# Altium project MainBoard.PrjPcb
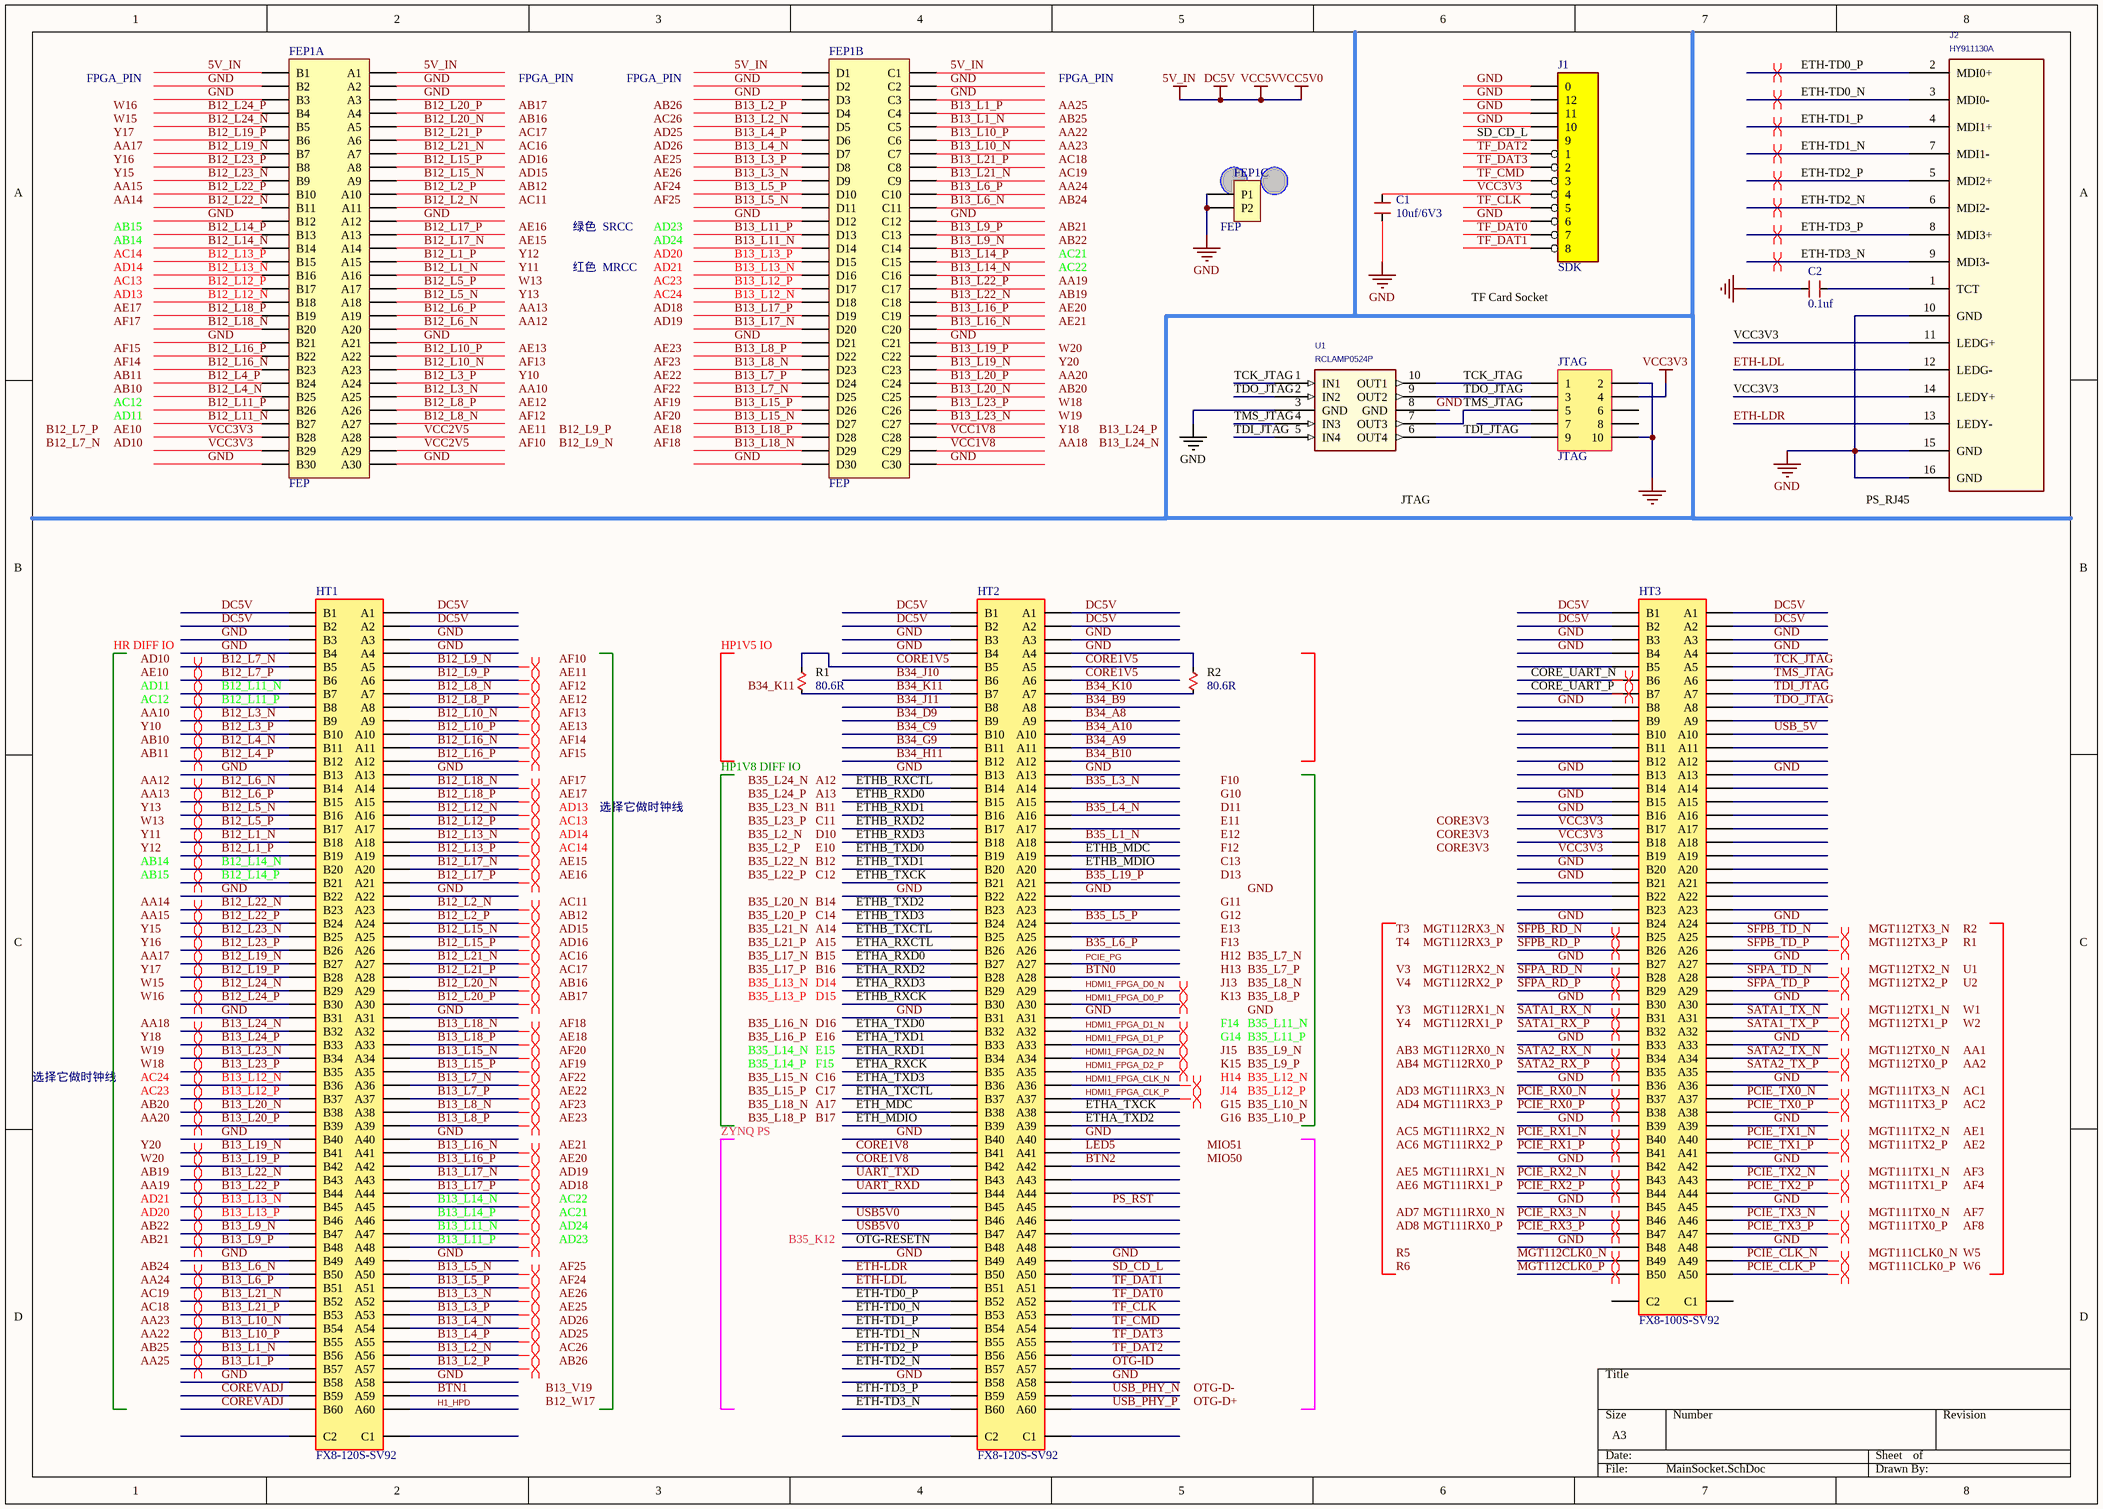
[diagram p0: MainSocket.SchDoc]
2 sheets, 57 parts. Net scope: global (net labels, ports and power ports of the same name join across sheets).
Board file: BASE.PcbDoc
Sheets:
  MainSocket.SchDoc
  Power.SchDoc

## Sheet MainSocket.SchDoc
size A3

### Parts
C1  10uf/6V3  [CAP0603]
C2  0.1uf  [CAP0402]
FEP1  FEP  [FEP-X2]  (parts A,B,C of 3)
HT1  FX8-120S-SV92  [FX8-120S-SV92]
HT2  FX8-120S-SV92  [FX8-120S-SV92]
HT3  FX8-100S-SV92  [FX8-100S-SV92]
J1  SDK  [TF_K]
J2  HY911130A  [HY911130A]
JTAG  JTAG  [HEADER5X2X2.0T]
R1  80.6R  [RES0402]
R2  80.6R  [RES0402]
U1  RCLAMP0524P  [SLP2510P8_10]

### Nets
5V_IN: FEP1.A1 FEP1.B1 FEP1.C1 FEP1.D1 HT1.A1 HT1.A2 HT1.B1 HT1.B2 HT2.A1 HT2.A2 HT2.B1 HT2.B2 HT3.A1 HT3.A2 HT3.B1 HT3.B2  [also labelled DC5V, VCC5V, VCC5V0]
GND: C1.2 C2.1 FEP1.A2 FEP1.A3 FEP1.A12 FEP1.A21 FEP1.A30 FEP1.B2 FEP1.B3 FEP1.B12 FEP1.B21 FEP1.B30 FEP1.C2 FEP1.C3 FEP1.C12 FEP1.C21 FEP1.C30 FEP1.D2 FEP1.D3 FEP1.D12 FEP1.D21 FEP1.D30 FEP1.P1 FEP1.P2 HT1.A3 HT1.A4 HT1.A13 HT1.A22 HT1.A31 HT1.A40 HT1.A49 HT1.A58 HT1.B3 HT1.B4 HT1.B13 HT1.B22 HT1.B31 HT1.B40 HT1.B49 HT1.B58 HT2.A3 HT2.A4 HT2.A13 HT2.A22 HT2.A31 HT2.A40 HT2.A49 HT2.A58 HT2.B3 HT2.B4 HT2.B13 HT2.B22 HT2.B31 HT2.B40 HT2.B49 HT2.B58 HT3.A3 HT3.A4 HT3.A13 HT3.A24 HT3.A27 HT3.A30 HT3.A33 HT3.A36 HT3.A39 HT3.A42 HT3.A45 HT3.A48 HT3.B3 HT3.B4 HT3.B8 HT3.B13 HT3.B15 HT3.B16 HT3.B20 HT3.B21 HT3.B24 HT3.B27 HT3.B30 HT3.B33 HT3.B36 HT3.B39 HT3.B42 HT3.B45 HT3.B48 J1.0 J1.6 J1.10 J1.11 J1.12 J2.10(GND) J2.15(GND) J2.16(GND) JTAG.2 JTAG.10 R2.2 U1.3(GND) U1.8(GND)
VCC1V8: FEP1.C28 FEP1.C29
VCC2V5: FEP1.A28 FEP1.A29
VCC3V3: C1.1 FEP1.B28 FEP1.B29 HT3.B17 HT3.B18 HT3.B19 J1.4 J2.11(LEDG+) J2.14(LEDY+) JTAG.4
B12_L1_N: FEP1.A16 HT1.B18
B12_L1_P: FEP1.A15 HT1.B19
B12_L2_N: FEP1.A11 HT1.A23
B12_L2_P: FEP1.A10 HT1.A24
B12_L3_N: FEP1.A25 HT1.B9
B12_L3_P: FEP1.A24 HT1.B10
B12_L4_N: FEP1.B25 HT1.B11
B12_L4_P: FEP1.B24 HT1.B12
B12_L5_N: FEP1.A18 HT1.B16
B12_L5_P: FEP1.A17 HT1.B17
B12_L6_N: FEP1.A20 HT1.B14
B12_L6_P: FEP1.A19 HT1.B15
B12_L7_N: HT1.B5
B12_L7_P: HT1.B6
B12_L8_N: FEP1.A27 HT1.A7
B12_L8_P: FEP1.A26 HT1.A8
B12_L9_N: HT1.A5
B12_L9_P: HT1.A6
B12_L10_N: FEP1.A23 HT1.A9
B12_L10_P: FEP1.A22 HT1.A10
B12_L11_N: FEP1.B27 HT1.B7
B12_L11_P: FEP1.B26 HT1.B8
B12_L12_N: FEP1.B18 HT1.A16
B12_L12_P: FEP1.B17 HT1.A17
B12_L13_N: FEP1.B16 HT1.A18
B12_L13_P: FEP1.B15 HT1.A19
B12_L14_N: FEP1.B14 HT1.B20
B12_L14_P: FEP1.B13 HT1.B21
B12_L15_N: FEP1.A9 HT1.A25
B12_L15_P: FEP1.A8 HT1.A26
B12_L16_N: FEP1.B23 HT1.A11
B12_L16_P: FEP1.B22 HT1.A12
B12_L17_N: FEP1.A14 HT1.A20
B12_L17_P: FEP1.A13 HT1.A21
B12_L18_N: FEP1.B20 HT1.A14
B12_L18_P: FEP1.B19 HT1.A15
B12_L19_N: FEP1.B7 HT1.B27
B12_L19_P: FEP1.B6 HT1.B28
B12_L20_N: FEP1.A5 HT1.A29
B12_L20_P: FEP1.A4 HT1.A30
B12_L21_N: FEP1.A7 HT1.A27
B12_L21_P: FEP1.A6 HT1.A28
B12_L22_N: FEP1.B11 HT1.B23
B12_L22_P: FEP1.B10 HT1.B24
B12_L23_N: FEP1.B9 HT1.B25
B12_L23_P: FEP1.B8 HT1.B26
B12_L24_N: FEP1.B5 HT1.B29
B12_L24_P: FEP1.B4 HT1.B30
B13_L1_N: FEP1.C5 HT1.B56
B13_L1_P: FEP1.C4 HT1.B57
B13_L2_N: FEP1.D5 HT1.A56
B13_L2_P: FEP1.D4 HT1.A57
B13_L3_N: FEP1.D9 HT1.A52
B13_L3_P: FEP1.D8 HT1.A53
B13_L4_N: FEP1.D7 HT1.A54
B13_L4_P: FEP1.D6 HT1.A55
B13_L5_N: FEP1.D11 HT1.A50
B13_L5_P: FEP1.D10 HT1.A51
B13_L6_N: FEP1.C11 HT1.B50
B13_L6_P: FEP1.C10 HT1.B51
B13_L7_N: FEP1.D25 HT1.A36
B13_L7_P: FEP1.D24 HT1.A37
B13_L8_N: FEP1.D23 HT1.A38
B13_L8_P: FEP1.D22 HT1.A39
B13_L9_N: FEP1.C14 HT1.B47
B13_L9_P: FEP1.C13 HT1.B48
B13_L10_N: FEP1.C7 HT1.B54
B13_L10_P: FEP1.C6 HT1.B55
B13_L11_N: FEP1.D14 HT1.A47
B13_L11_P: FEP1.D13 HT1.A48
B13_L12_N: FEP1.D18 HT1.B36
B13_L12_P: FEP1.D17 HT1.B37
B13_L13_N: FEP1.D16 HT1.B45
B13_L13_P: FEP1.D15 HT1.B46
B13_L14_N: FEP1.C16 HT1.A45
B13_L14_P: FEP1.C15 HT1.A46
B13_L15_N: FEP1.D27 HT1.A34
B13_L15_P: FEP1.D26 HT1.A35
B13_L16_N: FEP1.C20 HT1.A41
B13_L16_P: FEP1.C19 HT1.A42
B13_L17_N: FEP1.D20 HT1.A43
B13_L17_P: FEP1.D19 HT1.A44
B13_L18_N: FEP1.D29 HT1.A32
B13_L18_P: FEP1.D28 HT1.A33
B13_L19_N: FEP1.C23 HT1.B41
B13_L19_P: FEP1.C22 HT1.B42
B13_L20_N: FEP1.C25 HT1.B38
B13_L20_P: FEP1.C24 HT1.B39
B13_L21_N: FEP1.C9 HT1.B52
B13_L21_P: FEP1.C8 HT1.B53
B13_L22_N: FEP1.C18 HT1.B43
B13_L22_P: FEP1.C17 HT1.B44
B13_L23_N: FEP1.C27 HT1.B34
B13_L23_P: FEP1.C26 HT1.B35
B13_L24_N: HT1.B32
B13_L24_P: HT1.B33
B34_A8: HT2.A9
B34_A9: HT2.A11
B34_A10: HT2.A10
B34_B9: HT2.A8
B34_B10: HT2.A12
B34_C9: HT2.B10
B34_D9: HT2.B9
B34_G9: HT2.B11
B34_H11: HT2.B12
B34_J10: HT2.B6
B34_J11: HT2.B8
B34_K10: HT2.A7 R2.1
B34_K11: HT2.B7 R1.1
B35_L1_N: HT2.A18
B35_L3_N: HT2.A14
B35_L4_N: HT2.A16
B35_L5_P: HT2.A24
B35_L6_P: HT2.A26
B35_L19_P: HT2.A21
BTN0: HT2.A28
BTN1: HT1.A59
BTN2: HT2.A42
CORE1V5: HT2.A5 HT2.A6 HT2.B5 R1.2
CORE1V8: HT2.B41 HT2.B42
CORE_UART_N: HT3.B6
CORE_UART_P: HT3.B7
COREVADJ: HT1.B59 HT1.B60
ETH-LDL: HT2.B51 J2.12(LEDG-)
ETH-LDR: HT2.B50 J2.13(LEDY-)
ETH-TD0_N: HT2.B53 J2.3(MDI0-)
ETH-TD0_P: HT2.B52 J2.2(MDI0+)
ETH-TD1_N: HT2.B55 J2.7(MDI1-)
ETH-TD1_P: HT2.B54 J2.4(MDI1+)
ETH-TD2_N: HT2.B57 J2.6(MDI2-)
ETH-TD2_P: HT2.B56 J2.5(MDI2+)
ETH-TD3_N: HT2.B60 J2.9(MDI3-)
ETH-TD3_P: HT2.B59 J2.8(MDI3+)
ETH_MDC: HT2.B38
ETH_MDIO: HT2.B39
ETHA_RXCK: HT2.B35
ETHA_RXCTL: HT2.B26
ETHA_RXD0: HT2.B27
ETHA_RXD1: HT2.B34
ETHA_RXD2: HT2.B28
ETHA_RXD3: HT2.B29
ETHA_TXCK: HT2.A38
ETHA_TXCTL: HT2.B37
ETHA_TXD0: HT2.B32
ETHA_TXD1: HT2.B33
ETHA_TXD2: HT2.A39
ETHA_TXD3: HT2.B36
ETHB_MDC: HT2.A19
ETHB_MDIO: HT2.A20
ETHB_RXCK: HT2.B30
ETHB_RXCTL: HT2.B14
ETHB_RXD0: HT2.B15
ETHB_RXD1: HT2.B16
ETHB_RXD2: HT2.B17
ETHB_RXD3: HT2.B18
ETHB_TXCK: HT2.B21
ETHB_TXCTL: HT2.B25
ETHB_TXD0: HT2.B19
ETHB_TXD1: HT2.B20
ETHB_TXD2: HT2.B23
ETHB_TXD3: HT2.B24
H1_HPD: HT1.A60
HDMI1_FPGA_CLK_N: HT2.A36
HDMI1_FPGA_CLK_P: HT2.A37
HDMI1_FPGA_D0_N: HT2.A29
HDMI1_FPGA_D0_P: HT2.A30
HDMI1_FPGA_D1_N: HT2.A32
HDMI1_FPGA_D1_P: HT2.A33
HDMI1_FPGA_D2_N: HT2.A34
HDMI1_FPGA_D2_P: HT2.A35
LED5: HT2.A41
MGT112CLK0_N: HT3.B49
MGT112CLK0_P: HT3.B50
OTG-ID: HT2.A57
OTG-RESETN: HT2.B48
PCIE_CLK_N: HT3.A49
PCIE_CLK_P: HT3.A50
PCIE_PG: HT2.A27
PCIE_RX0_N: HT3.B37
PCIE_RX0_P: HT3.B38
PCIE_RX1_N: HT3.B40
PCIE_RX1_P: HT3.B41
PCIE_RX2_N: HT3.B43
PCIE_RX2_P: HT3.B44
PCIE_RX3_N: HT3.B46
PCIE_RX3_P: HT3.B47
PCIE_TX0_N: HT3.A37
PCIE_TX0_P: HT3.A38
PCIE_TX1_N: HT3.A40
PCIE_TX1_P: HT3.A41
PCIE_TX2_N: HT3.A43
PCIE_TX2_P: HT3.A44
PCIE_TX3_N: HT3.A46
PCIE_TX3_P: HT3.A47
PS_RST: HT2.A45
SATA1_RX_N: HT3.B31
SATA1_RX_P: HT3.B32
SATA1_TX_N: HT3.A31
SATA1_TX_P: HT3.A32
SATA2_RX_N: HT3.B34
SATA2_RX_P: HT3.B35
SATA2_TX_N: HT3.A34
SATA2_TX_P: HT3.A35
SD_CD_L: HT2.A50 J1.9
SFPA_RD_N: HT3.B28
SFPA_RD_P: HT3.B29
SFPA_TD_N: HT3.A28
SFPA_TD_P: HT3.A29
SFPB_RD_N: HT3.B25
SFPB_RD_P: HT3.B26
SFPB_TD_N: HT3.A25
SFPB_TD_P: HT3.A26
TCK_JTAG: HT3.A5 JTAG.1 U1.1(IN1) U1.10(OUT1)
TDI_JTAG: HT3.A7 JTAG.9 U1.5(IN4) U1.6(OUT4)
TDO_JTAG: HT3.A8 JTAG.3 U1.2(IN2) U1.9(OUT2)
TF_CLK: HT2.A53 J1.5
TF_CMD: HT2.A54 J1.3
TF_DAT0: HT2.A52 J1.7
TF_DAT1: HT2.A51 J1.8
TF_DAT2: HT2.A56 J1.1
TF_DAT3: HT2.A55 J1.2
TMS_JTAG: HT3.A6 JTAG.5 U1.4(IN3) U1.7(OUT3)
UART_RXD: HT2.B44
UART_TXD: HT2.B43
USB5V0: HT2.B46 HT2.B47
USB_5V: HT3.A10
USB_PHY_N: HT2.A59
USB_PHY_P: HT2.A60
NetC2_2: C2.2 J2.1(TCT)

Not connected (* = marked no-connect by the designer): HT1 C1 C2; HT2 A15 A17 A23 A25 A43 A44 A46 A47 A48 B45 C1 C2; HT3 A9 A11 A12 A14 A15 A16 A17 A18 A19 A20 A21 A22 A23 B5 B9 B10 B11 B12 B14 B22 B23 C1 C2; JTAG 6 7 8

### Layout directives
differential pair: B12_L1_N, B12_L1_P, B12_L2_N, B12_L2_P, B12_L3_N, B12_L3_P, B12_L4_N, B12_L4_P, B12_L5_N, B12_L5_P, B12_L6_N, B12_L6_P, B12_L7_N, B12_L7_P, B12_L8_N, B12_L8_P, B12_L9_N, B12_L9_P, B12_L10_N, B12_L10_P, B12_L11_N, B12_L11_P, B12_L12_N, B12_L12_P, B12_L13_N, B12_L13_P, B12_L14_N, B12_L14_P, B12_L15_N, B12_L15_P, B12_L16_N, B12_L16_P, B12_L17_N, B12_L17_P, B12_L18_N, B12_L18_P, B12_L19_N, B12_L19_P, B12_L20_N, B12_L20_P, B12_L21_N, B12_L21_P, B12_L22_N, B12_L22_P, B12_L23_N, B12_L23_P, B12_L24_N, B12_L24_P, B13_L1_N, B13_L1_P, B13_L2_N, B13_L2_P, B13_L3_N, B13_L3_P, B13_L4_N, B13_L4_P, B13_L5_N, B13_L5_P, B13_L6_N, B13_L6_P, B13_L7_N, B13_L7_P, B13_L8_N, B13_L8_P, B13_L9_N, B13_L9_P, B13_L10_N, B13_L10_P, B13_L11_N, B13_L11_P, B13_L12_N, B13_L12_P, B13_L13_N, B13_L13_P, B13_L14_N, B13_L14_P, B13_L15_N, B13_L15_P, B13_L16_N, B13_L16_P, B13_L17_N, B13_L17_P, B13_L18_N, B13_L18_P, B13_L19_N, B13_L19_P, B13_L20_N, B13_L20_P, B13_L21_N, B13_L21_P, B13_L22_N, B13_L22_P, B13_L23_N, B13_L23_P, B13_L24_N, B13_L24_P, CORE_UART_N, CORE_UART_P, ETH-TD0_N, ETH-TD0_P, ETH-TD1_N, ETH-TD1_P, ETH-TD2_N, ETH-TD2_P, ETH-TD3_N, ETH-TD3_P, HDMI1_FPGA_CLK_N, HDMI1_FPGA_CLK_P, HDMI1_FPGA_D0_N, HDMI1_FPGA_D0_P, HDMI1_FPGA_D1_N, HDMI1_FPGA_D1_P, HDMI1_FPGA_D2_N, HDMI1_FPGA_D2_P, MGT112CLK0_N, MGT112CLK0_P, PCIE_CLK_N, PCIE_CLK_P, PCIE_RX0_N, PCIE_RX0_P, PCIE_RX1_N, PCIE_RX1_P, PCIE_RX2_N, PCIE_RX2_P, PCIE_RX3_N, PCIE_RX3_P, PCIE_TX0_N, PCIE_TX0_P, PCIE_TX1_N, PCIE_TX1_P, PCIE_TX2_N, PCIE_TX2_P, PCIE_TX3_N, PCIE_TX3_P, SATA1_RX_N, SATA1_RX_P, SATA1_TX_N, SATA1_TX_P, SATA2_RX_N, SATA2_RX_P, SATA2_TX_N, SATA2_TX_P, SFPA_RD_N, SFPA_RD_P, SFPA_TD_N, SFPA_TD_P, SFPB_RD_N, SFPB_RD_P, SFPB_TD_N, SFPB_TD_P

### Notes on the sheet
- FPGA_PIN
- 绿色  SRCC
- 红色  MRCC
- (near J1) TF Card Socket
- JTAG
- (near J2) PS_RJ45
- HR DIFF IO
- (near R1) HP1V5 IO
- HP1V8 DIFF IO
- 选择它做时钟线
- Labels drawn without touching a wire or pin: A12, A13, A14, A15, A17, AA1, AA2, AA10, AA12, AA13, AA14, AA15, AA17, AA18, AA19, AA20, AA22, AA23, AA24, AA25, AB3, AB4, AB10, AB11, AB12, AB14, AB15, AB16, AB17, AB19, AB20, AB21, AB22, AB24, AB25, AB26, AC1, AC2, AC5, AC6, AC11, AC12, AC13, AC14, AC16, AC17, AC18, AC19, AC21, AC22, AC23, AC24, AC26, AD3, AD4, AD7, AD8, AD10, AD11, AD13, AD14, AD15, AD16, AD18, AD19, AD20, AD21, AD23, AD24, AD25, AD26, AE1, AE2, AE5, AE6, AE10, AE11, AE12, AE13, AE15, AE16, AE17, AE18, AE20, AE21, AE22, AE23, AE25, AE26, AF3, AF4, AF7, AF8, AF10, AF12, AF13, AF14, AF15, AF17, AF18, AF19, AF20, AF22, AF23, AF24, AF25, B11, B12, B12_L7_N, B12_L7_P, B12_L9_N, B12_L9_P, B12_W17, B13_L24_N, B13_L24_P, B13_V19, B14, B15, B16, B17, B34_K11, B35_K12, B35_L2_N, B35_L2_P, B35_L7_N, B35_L7_P, B35_L8_N, B35_L8_P, B35_L9_N, B35_L9_P, B35_L10_N, B35_L10_P, B35_L11_N, B35_L11_P, B35_L12_N, B35_L12_P, B35_L13_N, B35_L13_P, B35_L14_N, B35_L14_P, B35_L15_N, B35_L15_P, B35_L16_N, B35_L16_P, B35_L17_N, B35_L17_P, B35_L18_N, B35_L18_P, B35_L20_N, B35_L20_P, B35_L21_N, B35_L21_P, B35_L22_N, B35_L22_P, B35_L23_N, B35_L23_P, B35_L24_N, B35_L24_P, C11, C12, C13, C14, C16, C17, CORE3V3, D10, D11, D13, D14, D15, D16, E10, E11, E12, E13, E15, E16, F10, F12, F13, F14, F15, G10, G11, G12, G14, G15, G16, GND, H12, H13, H14, J13, J14, J15, K13, K15, MGT111CLK0_N, MGT111CLK0_P, MGT111RX0_N, MGT111RX0_P, MGT111RX1_N, MGT111RX1_P, MGT111RX2_N, MGT111RX2_P, MGT111RX3_N, MGT111RX3_P, MGT111TX0_N, MGT111TX0_P, MGT111TX1_N, MGT111TX1_P, MGT111TX2_N, MGT111TX2_P, MGT111TX3_N, MGT111TX3_P, MGT112RX0_N, MGT112RX0_P, MGT112RX1_N, MGT112RX1_P, MGT112RX2_N, MGT112RX2_P, MGT112RX3_N, MGT112RX3_P, MGT112TX0_N, MGT112TX0_P, MGT112TX1_N, MGT112TX1_P, MGT112TX2_N, MGT112TX2_P, MGT112TX3_N, MGT112TX3_P, MIO50, MIO51, OTG-D+, OTG-D-, R1, R2, R5, T3, T4, U1, U2, V3, V4, W1, W2, W5, W6, W13, W15, W16, W18, W19, W20, Y3, Y4, Y10, Y11, Y12, Y13, Y15, Y16, Y17, Y18, Y20

### Library data of the parts
C1 = CAPACITOR: Generic Capacitor; Value: 4.7uF; DPN: *; Manufacturer: *
C2 = CAPACITOR: Generic Capacitor; DPN: *; Manufacturer: *
FEP1 = FEP-2X
HT1 HT2 = FX8-120P-SV92
HT3 = FX8-100P-SV92
J1 = SD
JTAG = HEADER2X5
R1 R2 = RESISTOR: Generic Resistor; Value: 10K; Manufacturer: *; DPN: *

## Sheet Power.SchDoc
size A4
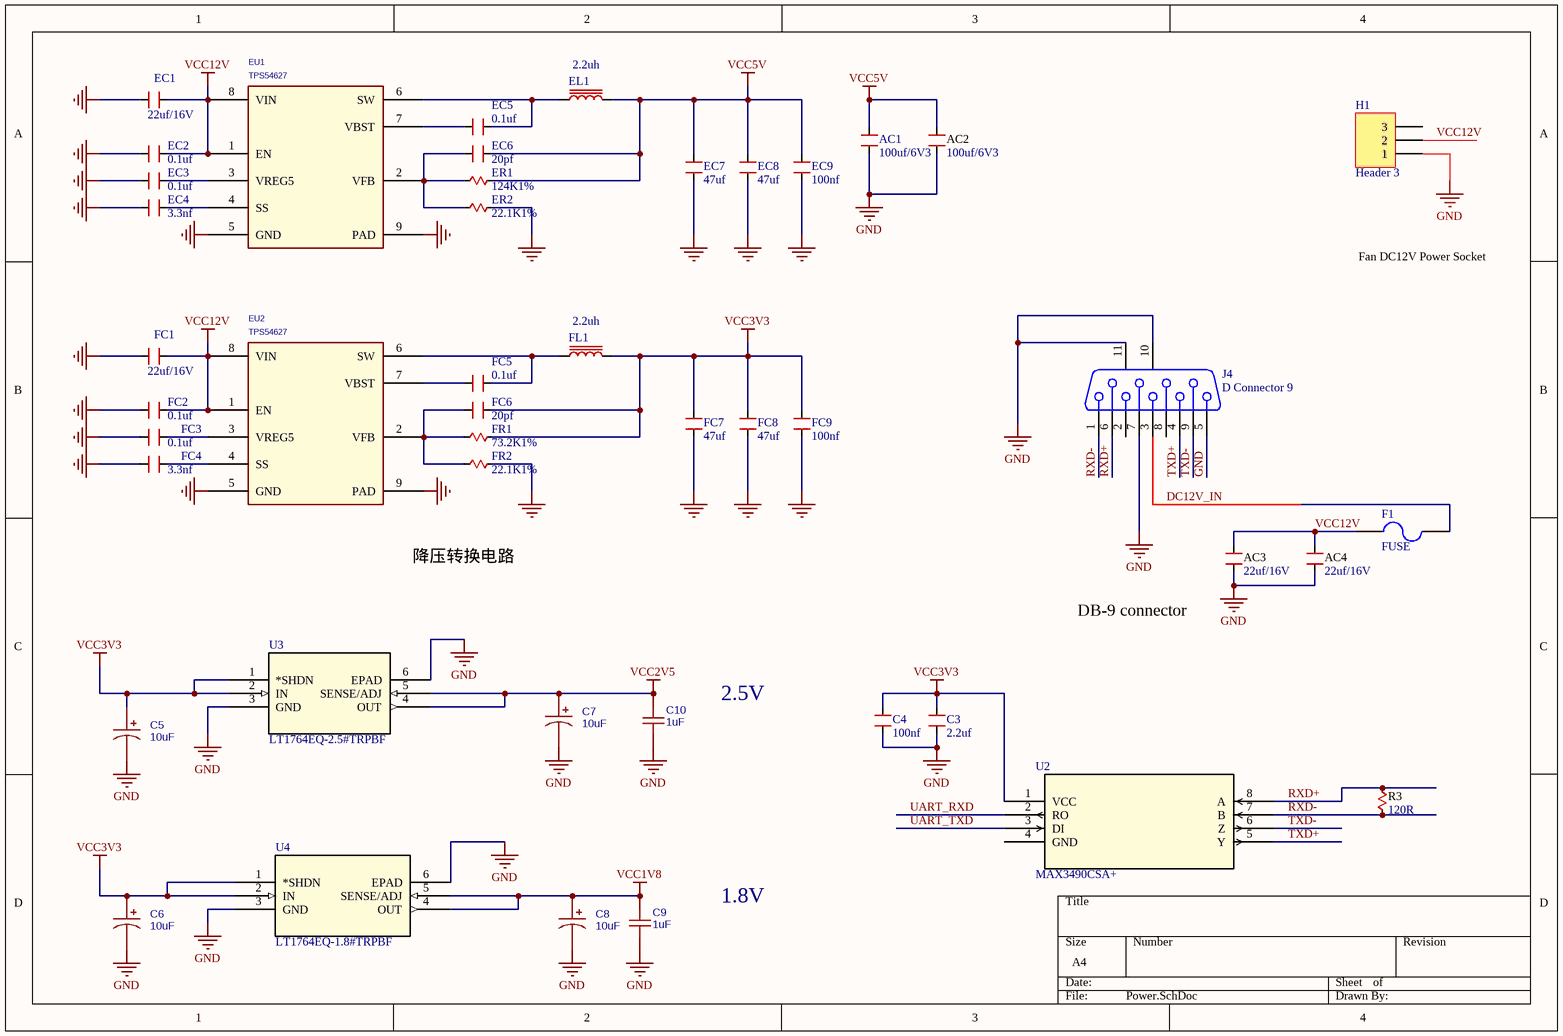
[diagram p1: Power.SchDoc]

### Parts
AC1  100uf/6V3  [CAP1206]
AC2  100uf/6V3  [CAP1206]
AC3  22uf/16V  [CAP1206]
AC4  22uf/16V  [CAP1206]
C3  2.2uf  [CAP0402]
C4  100nf  [CAP0402]
C5  10uF  [CASE-A_3216]
C6  10uF  [CASE-A_3216]
C7  10uF  [CASE-A_3216]
C8  10uF  [CASE-A_3216]
C9  1uF  [CAP0402]
C10  1uF  [CAP0402]
EC1  22uf/16V  [CAP1206]
EC2  0.1uf  [CAP0402]
EC3  0.1uf  [CAP0402]
EC4  3.3nf  [CAP0402]
EC5  0.1uf  [CAP0402]
EC6  20pf  [CAP0402]
EC7  47uf  [CAP0603]
EC8  47uf  [CAP0603]
EC9  100nf  [CAP0402]
EL1  2.2uh  [L4X4X2]
ER1  124K1%  [CAP0603]
ER2  22.1K1%  [CAP0603]
EU1  TPS54627  [SOP8_EP_127P4X5X1_5]
EU2  TPS54627  [SOP8_EP_127P4X5X1_5]
F1  FUSE  [1206]
FC1  22uf/16V  [CAP1206]
FC2  0.1uf  [CAP0402]
FC3  0.1uf  [CAP0402]
FC4  3.3nf  [CAP0402]
FC5  0.1uf  [CAP0402]
FC6  20pf  [CAP0402]
FC7  47uf  [CAP0603]
FC8  47uf  [CAP0603]
FC9  100nf  [CAP0402]
FL1  2.2uh  [L4X4X2]
FR1  73.2K1%  [CAP0603]
FR2  22.1K1%  [CAP0603]
H1  Header 3  [HDR1X3]
J4  D Connector 9  [DSUB1.385-2H9]
R3  120R  [RES0402]
U2  MAX3490CSA+  [21-0041B_8_MXM]
U3  LT1764EQ-2.5#TRPBF  [DDPAK-5_Q]
U4  LT1764EQ-1.8#TRPBF  [DDPAK-5_Q]

### Nets
GND: AC1.1 AC2.1 AC3.1 AC4.1 C3.2 C4.2 C5.2 C6.2 C7.2 C8.2 C9.1 C10.1 EC1.1 EC2.1 EC3.1 EC4.1 EC7.1 EC8.1 EC9.1 ER2.1 EU1.5(GND) EU1.9(PAD) EU2.5(GND) EU2.9(PAD) FC1.1 FC2.1 FC3.1 FC4.1 FC7.1 FC8.1 FC9.1 FR2.1 H1.1 J4.5 J4.7 J4.10(MH1) J4.11(MH2) U3.3(GND) U3.6(EPAD) U4.3(GND) U4.6(EPAD)
VCC1V8: C8.1 C9.2 U4.4(OUT) U4.5(SENSE/ADJ)
VCC2V5: C7.1 C10.2 U3.4(OUT) U3.5(SENSE/ADJ)
VCC3V3: C3.1 C4.1 C5.1 C6.1 FC6.2 FC7.2 FC8.2 FC9.2 FL1.2 FR1.1 U2.1(VCC) U3.1(*SHDN) U3.2(IN) U4.1(*SHDN) U4.2(IN)
VCC5V: AC1.2 AC2.2 EC6.2 EC7.2 EC8.2 EC9.2 EL1.2 ER1.1  [project net 5V_IN]
VCC12V: AC3.2 AC4.2 EC1.2 EC2.2 EU1.1(EN) EU1.8(VIN) EU2.1(EN) EU2.8(VIN) F1.1 FC1.2 FC2.2 H1.2
DC12V_IN: F1.2 J4.3
RXD+: J4.6 R3.1 U2.8(A)
RXD-: J4.1 R3.2 U2.7(B)
TXD+: J4.4 U2.5(Y)
TXD-: J4.9 U2.6(Z)
UART_RXD: U2.2(RO)
UART_TXD: U2.3(DI)
NetEC3_2: EC3.2 EU1.3(VREG5)
NetEC4_2: EC4.2 EU1.4(SS)
NetEC5_1: EC5.1 EU1.7(VBST)
NetEC5_2: EC5.2 EL1.1 EU1.6(SW)
NetEC6_1: EC6.1 ER1.2 ER2.2 EU1.2(VFB)
NetEU2_2: EU2.2(VFB) FC6.1 FR1.2 FR2.2
NetEU2_3: EU2.3(VREG5) FC3.2
NetEU2_4: EU2.4(SS) FC4.2
NetEU2_6: EU2.6(SW) FC5.2 FL1.1
NetEU2_7: EU2.7(VBST) FC5.1

Not connected (* = marked no-connect by the designer): H1 3; J4 2 8; U2 4(GND)

### Notes on the sheet
- Fan DC12V Power Socket
- 降压转换电路
- (near AC3) DB-9 connector
- 2.5V
- 1.8V

### Library data of the parts
AC1 C3 EC1-EC9 FC1-FC9 = CAPACITOR: Generic Capacitor; DPN: *; Manufacturer: *
AC2-AC4 = CAPACITOR: Generic Capacitor; Value: 10nF; DPN: *; Manufacturer: *
C4 = CAPACITOR_1: Generic Capacitor; DPN: *; Manufacturer: *
C5-C8 = 150u: nameAlias: Value(F); Contributor: LCEDA_Lib; spicePre: C; spiceSymbolName: C_Tan_SMD_A_US
C9 C10 = 1u: nameAlias: Value(F); Contributor: LCEDA_Lib; spicePre: C; spiceSymbolName: C_0603_US
EL1 FL1 = Inductor: Generic Inductor; DPN: *; Manufacturer: *
ER1 ER2 FR1 FR2 = RESISTOR: Generic Resistor; Value: 4.7K; Manufacturer: *; DPN: *
EU1 EU2 = TPS54327
F1 = Fuse 2: Published: 8-Jun-2000; LatestRevisionDate: 17-Jul-2002; LatestRevisionNote: Re-released for DXP Platform.; PackageReference: PIN-W2/E2.8; Publisher: Altium Limited
H1 = Header 3: Header, 3-Pin; LatestRevisionDate: 17-Jul-2002; LatestRevisionNote: Re-released for DXP Platform.; Publisher: Altium Limited
J4 = D Connector 9: Receptacle Assembly, 9 Position, Right Angle; PackageDocument: O; Positions: 9; Published: 15-Jun-2001; LatestRevisionDate: 17-Jul-2002; LatestRevisionNote: Re-released for DXP Platform.; DatasheetDocument: 1-Sep-1999; PackageReference: 788750; Publisher: Altium Limited; Orientation: Right Angle; Gender: Receptacle
R3 = RESISTOR: Generic Resistor; Value: 10K; Manufacturer: *; DPN: *
U2 = MAX3490CSA+: No Description Available; Vendor: Maxim Integrated Products; Built_By: EMA_UL_Team; SourceLibrary: Maxim_2011-10-27; Manufacturer_Part_Number: MAX3490CSA+; Revision: 3; Copyright: Copyright (C) 2018 Accelerated Designs. All rights reserved; RefDes: RefDes; Type: DEV
U3 = LT1764EQ-2.5#TRPBF: No Description Available; Vendor: Linear Technology; Manufacturer_Part_Number: lt1764eq-2.5#trpbf; Copyright: Copyright (C) 2018 Accelerated Designs. All rights reserved; RefDes: RefDes; Type: DEV
U4 = LT1764EQ-1.8#TRPBF: No Description Available; Vendor: Linear Technology; Manufacturer_Part_Number: lt1764eq-1.8#trpbf; Copyright: Copyright (C) 2018 Accelerated Designs. All rights reserved; RefDes: RefDes; Type: DEV

## Nets that join several sheets
5V_IN: MainSocket (16 pins), Power (8 pins)
GND: MainSocket (98 pins), Power (41 pins)
VCC1V8: MainSocket (FEP1.C28 FEP1.C29), Power (C8.1 C9.2 U4.4 U4.5)
VCC2V5: MainSocket (FEP1.A28 FEP1.A29), Power (C7.1 C10.2 U3.4 U3.5)
VCC3V3: MainSocket (10 pins), Power (15 pins)
UART_RXD: MainSocket (HT2.B44), Power (U2.2)
UART_TXD: MainSocket (HT2.B43), Power (U2.3)